# Altium schematic sheet CANBUS_Pendant.SchDoc: RP2040 CNC
size B; Author: AM; CompanyName: Expatria Technologies; DrawnBy: A.Marles; Engineer: AM; Organization: Expatria Technolgoies; Address1: PO Box 2084; Address3: Merritt, BC V1K 1B8; Address4: Canada; DocumentNumber: 26; SheetNumber: 23; SheetTotal: 26
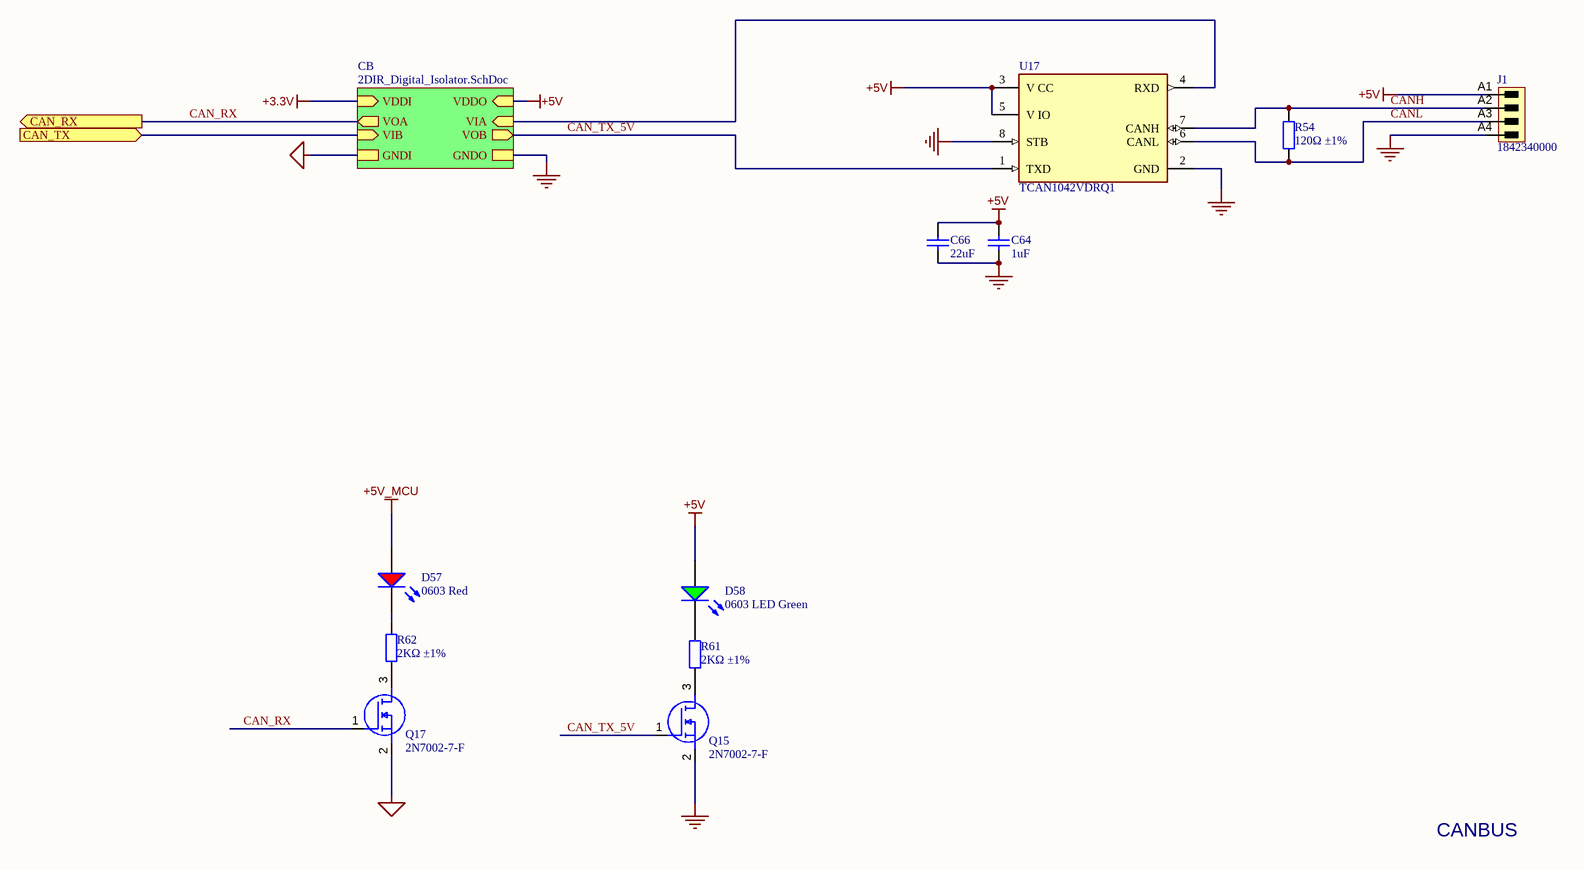
[diagram p0: CANBUS_Pendant.SchDoc]

## Parts
C64  1uF  [0603_C]
C66  22uF  [0603_C]
D57  0603 Red  [0603_LED_S1]
D58  0603 LED Green  [0603_LED_S1]
J1  1842340000  [691321100004]
Q15  2N7002-7-F  [SOT-23(SOT-23-3)]
Q17  2N7002-7-F  [SOT-23(SOT-23-3)]
R54  120Ω ±1%  [0805_R]
R61  2KΩ ±1%  [0402_R]
R62  2KΩ ±1%  [0402_R]
U17  TCAN1042VDRQ1  [FP-D0008B-IPC_C]

## Sub-sheets
CB = 2DIR_Digital_Isolator.SchDoc: VDDO (in), VIB (in), VIA (in), VOB (out), VOA (out), VDDI (in), GNDO, GNDI

## Ports
CAN_RX (out), CAN_TX (in)

## Nets
+3.3V: sheet CB/VDDI
+5V: C64.2 C66.2 D58.A J1.A1 U17.3(V_CC) U17.5(V_IO) ; sheet CB/VDDO
+5V_MCU: D57.A
GND: C64.1 C66.1 J1.A4 Q15.2(S) U17.2(GND) U17.8(STB) ; sheet CB/GNDO
MCU_GND: Q17.2(S) ; sheet CB/GNDI
CAN_RX: Q17.1(G) ; port CAN_RX, sheet CB/VOA
CAN_TX: port CAN_TX, sheet CB/VIB
CAN_TX_5V: Q15.1(G) U17.1(TXD) ; sheet CB/VOB
CANH: J1.A2 R54.2 U17.7(CANH)
CANL: J1.A3 R54.1 U17.6(CANL)
NetD57_K: D57.K R62.2
NetD58_K: D58.K R61.2
NetQ15_3: Q15.3(D) R61.1
NetQ17_3: Q17.3(D) R62.1
NetU17_4: U17.4(RXD) ; sheet CB/VIA

## Notes on the sheet
- CANBUS
- SHEET
- Expatria Technologies
- PO Box 2084
- Merritt, BC V1K 1B8
- PHONE: (778) 238-9336
- PROJECT
- SIZE
- ENGR
- MODIFIED
- DOCUMENT
- REV
- Copyright Expatria Technologies 2022. This document describes Open Hardware and is licensed under the CERN-OHL-S v2. No warranty is implied or expressed.
- EMAIL: info@expatria.ca
- B
- /

## Library data of the parts
C64 = 0603 1uF (105) 10% 50V: Chip capacitors; Manufacturer: Samsung Electro-Mechanics; Manufacturer Part Number: CL10A105KB8NNNC; Tolerance: 10%; Voltage: 50V; ComponentLink1Description: Supplier link; ComponentLink1URL: http://www.szlcsc.com/product/details_16531.html; Package: 0603; Supplier: LCSC; SuppliersPartNumber: C15849; Capacitance: 1uF
C66 = 0603 22uF (226) 20% 6.3V: Chip capacitors; Manufacturer: Samsung Electro-Mechanics; PartNumber: CL10A226MQ8NRNC; Tolerance: 20%; Voltage: 6.3V; ComponentLink1Description: Supplier link; ComponentLink1URL: http://www.szlcsc.com/product/details_60514.html; Package: 0603; Supplier: LC; SuppliersPartNumber: C59461; Capacitance: 22uF
D57 = 19-213SURC/S530-A3/TR8: 20mA 632nm Colorless transparence 624nm~624nm -40℃~+85℃ Red 120° 60mW 0603 Light Emitting Diodes (LED) ROHS; Manufacturer: Everlight Elec; ComponentLink1Description: 供应商链接; ComponentLink1URL: http://www.szlcsc.com/product/details_2659.html; Package: 0603; Supplier: LC; SuppliersPartNumber: C72039; Color: Red; Supplier 1: LC; Supplier Part Number 1: C72039; Manufacturer Part Number: 19-213SURC/S530-A3/TR8
D58 = 19-217/GHC-YR1S2/3T: Colorless transparence -40℃~+85℃ 520nm~535nm Emerald 120° 110mW 0603 Light Emitting Diodes (LED) ROHS; Manufacturer: Everlight Elec; Package: 0603; Supplier: LC; SuppliersPartNumber: C72043; Color: Green; Manufacturer Part Number: 19-217/GHC-YR1S2/3T
J1 = 3.5mm Terminal Header 4p: OMNIMATE Signal - series BL/SL 3.50; Revision: V1; SuppliersPartNumber: C880556; ComponentLink1URL: http://www.weidmueller.com/; ComponentLink1Description: Manufacturer URL; Supplier: LCSC
Q15 Q17 = 2N7002-7-F: 60V 115mA 7.5Ω@5V,50mA 370mW N Channel SOT-23 MOSFETs ROHS; Manufacturer: Diodes Inc.; SuppliersPartNumber: C85049; Manufacturer Part Number: 2N7002-7-F; Value: 2N7002-7-F; Datasheet Link: https://datasheet.datasheetarchive.com/originals/distributors/SFDatasheet-0/sf-0003625.pdf; Height: 1.2mm; Manufacturer_Part_Number: 2N7002-7-F; Mouser Part Number: 621-2N7002-F; Mouser Price/Stock: https://www.mouser.co.uk/ProductDetail/Diodes-Incorporated/2N7002-7-F?qs=jMXWnm70%252BC%252BAX%252BMLzUkTZg%3D%3D; Arrow Part Number: 2N7002-7-F; Arrow Price/Stock: https://www.arrow.com/en/products/2n7002-7-f/diodes-incorporated?region=nac
R54 = 0805 120R (1200) 1%: Chip resistor; Manufacturer: Uniroyal Elec; Manufacturer Part Number: 0805W8F1200T5E; Power: 1/8W; ComponentLink1Description: Supplier link; ComponentLink1URL: http://www.szlcsc.com/product/details_18125.html; Package: 0805; Supplier: LCSC; SuppliersPartNumber: C17437; Tolerance: 1%
R61 R62 = 0402 2K (2001) 1%: Chip resistor; Manufacturer: Uniroyal Elec; Manufacturer Part Number: 0402WGF2001TCE; Power: 1/16W; ComponentLink1Description: Supplier link; ComponentLink1URL: http://www.szlcsc.com/product/details_4516.html; Package: 0402; Supplier: LC; SuppliersPartNumber: C4109; Resistance: 2KΩ; Tolerance: 1%
U17 = CMP-04872-000073-1: IC TRANSCEIVER 1/1 8SOIC; Data Rate: 5Mbps; Max Operating Temperature: 125°C; Mount: Surface Mount; Packaging: Tape and Reel; Case/Package: SOIC; RoHS Compliant: Yes; Lead Free: Lead Free; Number of Pins: 8; Min Operating Temperature: -55°C